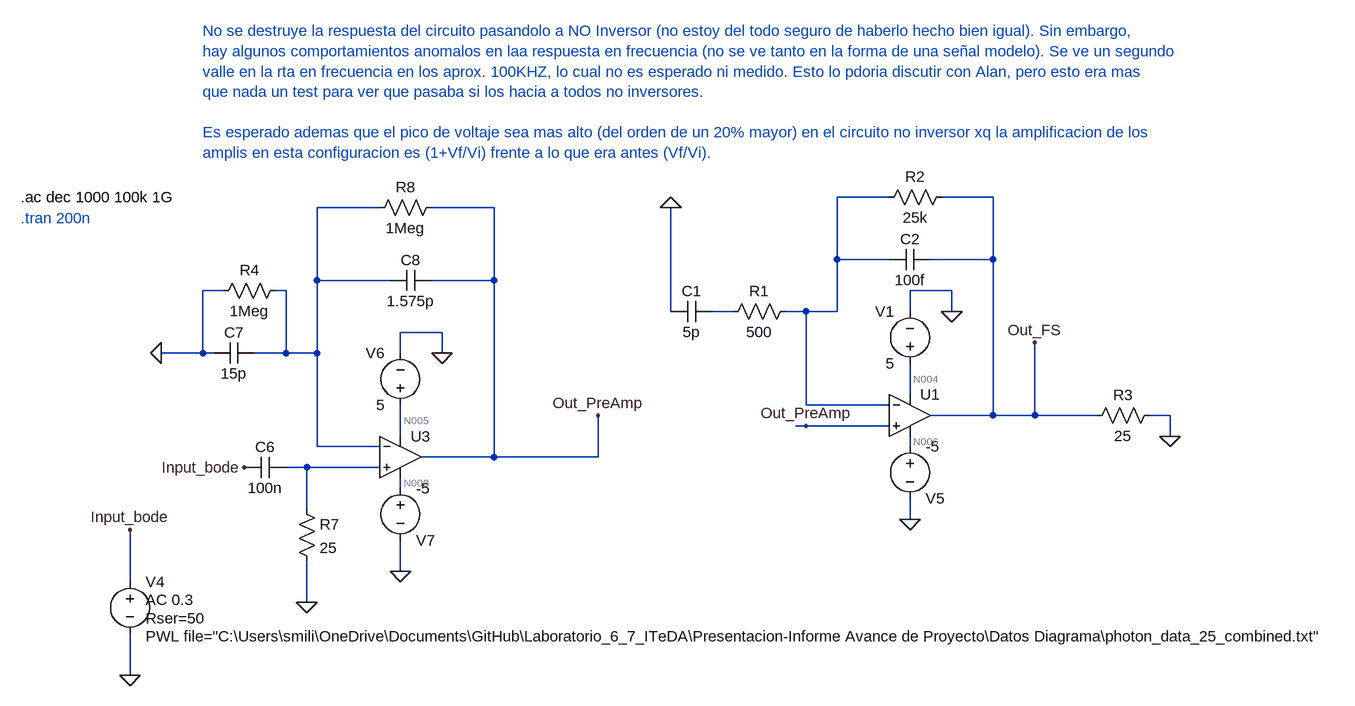
[diagram p0: schematic bode_circuito_completo_con_capacitores_en_preamp_NO_Inversor_actualizado.asc]
bode_circuito_completo_con_capacitores_en_preamp_NO_Inversor_actualizado.asc, the LTspice schematic file:
Version 4
SHEET 1 2644 1188
WIRE 768 16 688 16
WIRE 928 16 848 16
WIRE -16 32 -112 32
WIRE 160 32 64 32
WIRE 688 112 688 16
WIRE 768 112 688 112
WIRE 928 112 928 16
WIRE 928 112 832 112
WIRE -112 144 -112 32
WIRE 0 144 -112 144
WIRE 160 144 160 32
WIRE 160 144 64 144
WIRE -256 160 -288 160
WIRE -160 160 -176 160
WIRE 864 160 800 160
WIRE 432 192 432 32
WIRE 528 192 496 192
WIRE 640 192 608 192
WIRE 688 192 688 112
WIRE 688 192 640 192
WIRE 800 192 800 160
WIRE 864 192 864 160
WIRE 80 224 16 224
WIRE -288 256 -288 160
WIRE -288 256 -352 256
WIRE -272 256 -288 256
WIRE -160 256 -160 160
WIRE -160 256 -208 256
WIRE -112 256 -112 144
WIRE -112 256 -160 256
WIRE 16 256 16 224
WIRE 80 256 80 224
WIRE 800 320 800 272
WIRE 640 336 640 192
WIRE 768 336 640 336
WIRE 928 352 928 112
WIRE 928 352 832 352
WIRE 992 352 992 240
WIRE 992 352 928 352
WIRE 1088 352 992 352
WIRE 1200 352 1168 352
WIRE 640 368 624 368
WIRE 768 368 640 368
WIRE 16 384 16 336
WIRE 1200 384 1200 352
WIRE -112 400 -112 256
WIRE -16 400 -112 400
WIRE 800 400 800 384
WIRE 160 416 160 144
WIRE 160 416 48 416
WIRE 320 416 320 352
WIRE 320 416 160 416
WIRE -128 432 -160 432
WIRE -16 432 -128 432
WIRE 16 464 16 448
WIRE -128 496 -128 432
WIRE 800 512 800 480
WIRE 16 592 16 544
WIRE -400 608 -400 528
WIRE -128 640 -128 576
WIRE -400 752 -400 688
FLAG 864 192 0
FLAG 992 240 Out_FS
FLAG 1200 384 0
FLAG -400 752 0
FLAG -400 528 Input_bode
FLAG -224 432 Input_bode
FLAG -128 640 0
FLAG 16 592 0
FLAG 80 256 0
FLAG -352 256 0
FLAG 320 352 Out_PreAmp
FLAG 432 32 0
FLAG 800 512 0
FLAG 640 368 Out_PreAmp
SYMBOL res 624 176 R90
WINDOW 0 0 56 VBottom 2
WINDOW 3 32 56 VTop 2
SYMATTR InstName R1
SYMATTR Value 500
SYMBOL res 864 0 R90
WINDOW 0 0 56 VBottom 2
WINDOW 3 32 56 VTop 2
SYMATTR InstName R2
SYMATTR Value 25k
SYMBOL voltage 800 288 R180
WINDOW 0 24 96 Left 2
WINDOW 3 24 16 Left 2
WINDOW 123 0 0 Left 0
WINDOW 39 0 0 Left 0
SYMATTR InstName V1
SYMATTR Value 5
SYMBOL OpAmps\\UniversalOpAmp1 800 352 R0
SYMATTR InstName U1
SYMATTR Value2 Avol=1900 GBW=897.0831Meg Vos=0
SYMBOL res 1184 336 R90
WINDOW 0 0 56 VBottom 2
WINDOW 3 32 56 VTop 2
SYMATTR InstName R3
SYMATTR Value 25
SYMBOL cap 496 176 R90
WINDOW 0 0 32 VBottom 2
WINDOW 3 32 32 VTop 2
SYMATTR InstName C1
SYMATTR Value 5p
SYMBOL cap 832 96 R90
WINDOW 0 0 32 VBottom 2
WINDOW 3 32 32 VTop 2
SYMATTR InstName C2
SYMATTR Value 100f
SYMBOL voltage -400 592 R0
WINDOW 123 24 44 Left 2
WINDOW 39 24 72 Left 2
WINDOW 3 24 100 Left 2
SYMATTR Value2 AC 0.3
SYMATTR SpiceLine Rser=50
SYMATTR Value PWL file="C:\Users\smili\OneDrive\Documents\GitHub\Laboratorio_6_7_ITeDA\Presentacion-Informe Avance de Proyecto\Datos Diagrama\photon_data_25_combined.txt"
SYMATTR InstName V4
SYMBOL voltage 800 384 R0
WINDOW 0 24 96 Left 2
WINDOW 3 24 16 Left 2
WINDOW 123 0 0 Left 0
WINDOW 39 0 0 Left 0
SYMATTR InstName V5
SYMATTR Value -5
SYMBOL res -144 480 R0
SYMATTR InstName R7
SYMATTR Value 25
SYMBOL cap -160 416 R90
WINDOW 0 0 32 VBottom 2
WINDOW 3 32 32 VTop 2
SYMATTR InstName C6
SYMATTR Value 100n
SYMBOL voltage 16 352 R180
WINDOW 0 24 96 Left 2
WINDOW 3 24 16 Left 2
WINDOW 123 0 0 Left 0
WINDOW 39 0 0 Left 0
SYMATTR InstName V6
SYMATTR Value 5
SYMBOL voltage 16 448 R0
WINDOW 0 24 96 Left 2
WINDOW 3 24 16 Left 2
WINDOW 123 0 0 Left 0
WINDOW 39 0 0 Left 0
SYMATTR InstName V7
SYMATTR Value -5
SYMBOL OpAmps\\UniversalOpAmp1 16 416 R0
SYMATTR InstName U3
SYMATTR Value2 Avol=1900 GBW=897.0831Meg Vos=0
SYMBOL cap -208 240 R90
WINDOW 0 0 32 VBottom 2
WINDOW 3 32 32 VTop 2
SYMATTR InstName C7
SYMATTR Value 15p
SYMBOL cap 64 128 R90
WINDOW 0 0 32 VBottom 2
WINDOW 3 32 32 VTop 2
SYMATTR InstName C8
SYMATTR Value 1.575p
SYMBOL res 80 16 R90
WINDOW 0 0 56 VBottom 2
WINDOW 3 32 56 VTop 2
SYMATTR InstName R8
SYMATTR Value 1Meg
SYMBOL res -160 144 R90
WINDOW 0 0 56 VBottom 2
WINDOW 3 32 56 VTop 2
SYMATTR InstName R4
SYMATTR Value 1Meg
TEXT -568 48 Left 2 ;.tran 200n
TEXT -568 16 Left 2 !.ac dec 1000 100k 1G
TEXT -288 -240 Left 2 ;No se destruye la respuesta del circuito pasandolo a NO Inversor (no estoy del todo seguro de haberlo hecho bien igual). Sin embargo,\nhay algunos comportamientos anomalos en laa respuesta en frecuencia (no se ve tanto en la forma de una señal modelo). Se ve un segundo\nvalle en la rta en frecuencia en los aprox. 100KHZ, lo cual no es esperado ni medido. Esto lo pdoria discutir con Alan, pero esto era mas\nque nada un test para ver que pasaba si los hacia a todos no inversores.\n \nEs esperado ademas que el pico de voltaje sea mas alto (del orden de un 20% mayor) en el circuito no inversor xq la amplificacion de los \namplis en esta configuracion es (1+Vf/Vi) frente a lo que era antes (Vf/Vi).

The netlist it stands for:
* bode_circuito_completo_con_capacitores_en_preamp_NO_Inversor_actualizado.asc
R1 N001 N003 500
R2 Out_FS N001 25k
V1 N004 0 5
XU1 Out_PreAmp N001 N004 N006 Out_FS level1 Avol=1900 GBW=897.0831Meg Vos=0 En=0 Enk=0 In=0 Ink=0 Rin=500Meg  ; pins In+ In- V+ V- OUT
R3 0 Out_FS 25
C1 N003 0 5p
C2 Out_FS N001 100f
V4 Input_bode 0 PWL file="C:\Users\smili\OneDrive\Documents\GitHub\Laboratorio_6_7_ITeDA\Presentacion-Informe Avance de Proyecto\Datos Diagrama\photon_data_25_combined.txt" AC 0.3 Rser=50
V5 N006 0 -5
R7 N007 0 25
C6 N007 Input_bode 100n
V6 N005 0 5
V7 N008 0 -5
XU3 N007 N002 N005 N008 Out_PreAmp level1 Avol=1900 GBW=897.0831Meg Vos=0 En=0 Enk=0 In=0 Ink=0 Rin=500Meg  ; pins In+ In- V+ V- OUT
C7 N002 0 15p
C8 Out_PreAmp N002 1.575p
R8 Out_PreAmp N002 1Meg
R4 N002 0 1Meg
* .tran 200n
.ac dec 1000 100k 1G
* No se destruye la respuesta del circuito pasandolo a NO Inversor (no estoy del todo seguro de haberlo hecho bien igual). Sin embargo,
* hay algunos comportamientos anomalos en laa respuesta en frecuencia (no se ve tanto en la forma de una señal modelo). Se ve un segundo
* valle en la rta en frecuencia en los aprox. 100KHZ, lo cual no es esperado ni medido. Esto lo pdoria discutir con Alan, pero esto era mas
* que nada un test para ver que pasaba si los hacia a todos no inversores.
* Es esperado ademas que el pico de voltaje sea mas alto (del orden de un 20% mayor) en el circuito no inversor xq la amplificacion de los
* amplis en esta configuracion es (1+Vf/Vi) frente a lo que era antes (Vf/Vi).
.lib UniversalOpAmp1.lib
.backanno
.end

* Results of the author's LTspice run, read from the files saved beside the schematic
* Operating Point, zero values left out:
*   V(n004) = 5 V
*   V(n006) = -5 V
*   V(n005) = 5 V
*   V(n008) = -5 V
*   I(V1) = -10 nA
*   I(V5) = 10 nA
*   I(V6) = -10 nA
*   I(V7) = 10 nA
*   Ix(u1:3) = 10 nA
*   Ix(u1:4) = -10 nA
*   Ix(u3:3) = 10 nA
*   Ix(u3:4) = -10 nA
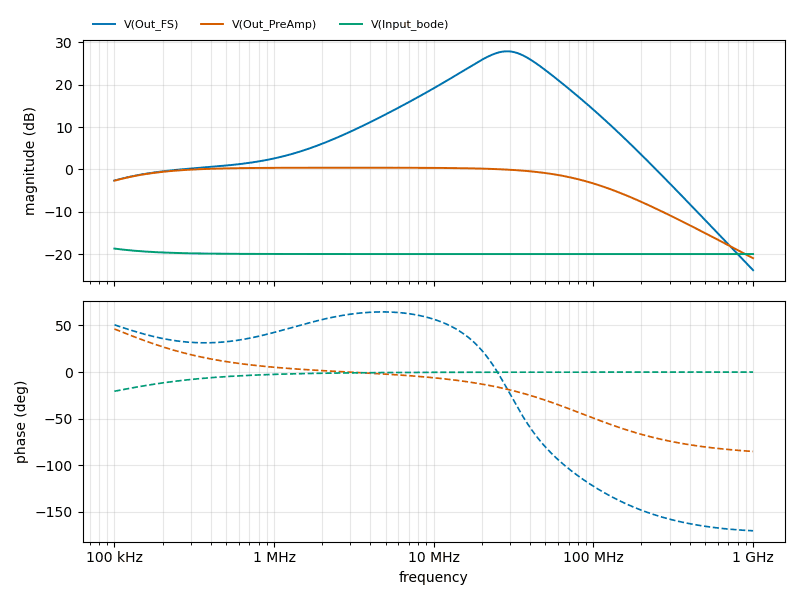
[diagram p1: AC Analysis of bode_circuito_completo_con_capacitores_en_preamp_NO_Inversor_actualizado.asc, plotted from the saved traces]
* AC Analysis, 1 run:
*   V(Out_FS): -2.65 dB at 100 kHz, -23.80 dB at 1 GHz, peak 27.88 dB at 28.77 MHz, 3 dB below the peak at 17.98 MHz and 44.38 MHz
*   V(Out_PreAmp): -2.67 dB at 100 kHz, -20.98 dB at 1 GHz, peak 0.39 dB at 2.944 MHz, 3 dB below the peak at 101.2 kHz and 85.84 MHz
*   V(Input_bode): -18.71 dB at 100 kHz, -20.00 dB at 1 GHz, peak -18.71 dB at 100 kHz